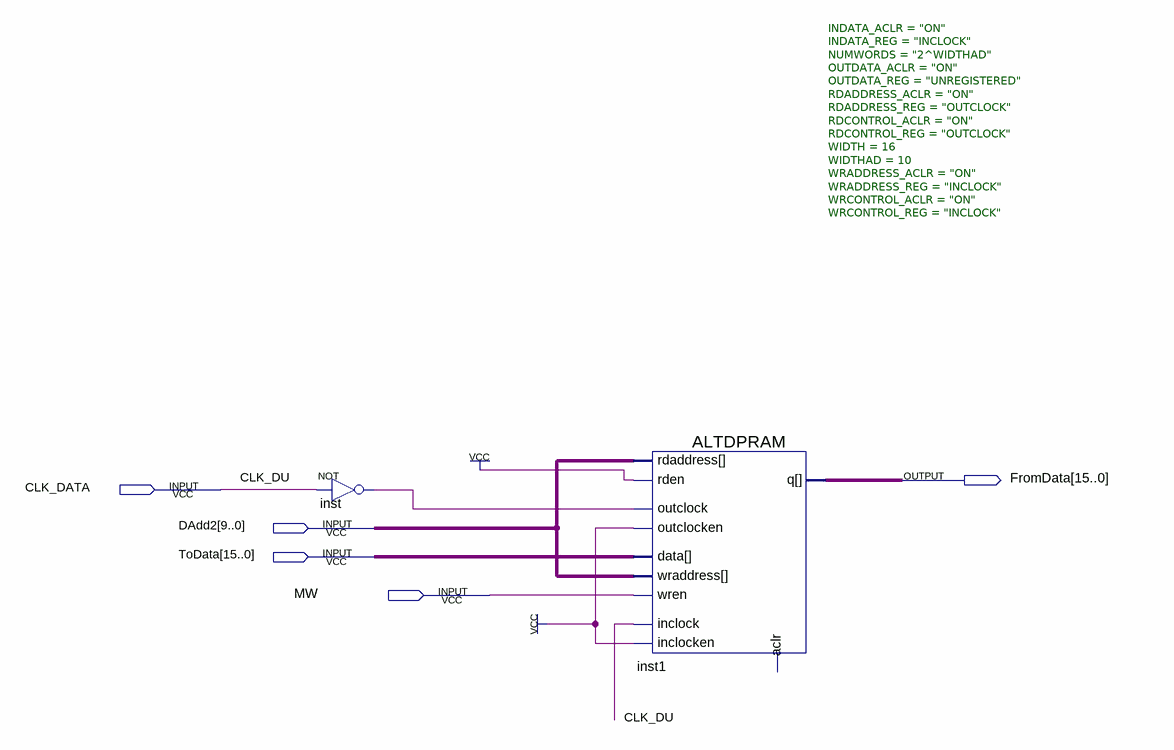
[diagram p0: schematic sheet]
// Quartus schematic dataUnit.bdf as structural Verilog: 2 symbols, 5 pins
module dataUnit (
  input  CLK_DATA,
  input  [9:0] DAdd2,
  input  [15:0] ToData,
  input  MW,
  output [15:0] FromData
);

  wire inst_out;

  not inst (inst_out, CLK_DATA);
  ALTDPRAM #(.INDATA_ACLR("ON"), .INDATA_REG("INCLOCK"), .NUMWORDS("2^WIDTHAD"), .OUTDATA_ACLR("ON"), .OUTDATA_REG("UNREGISTERED"), .RDADDRESS_ACLR("ON"), .RDADDRESS_REG("OUTCLOCK"), .RDCONTROL_ACLR("ON"), .RDCONTROL_REG("OUTCLOCK"), .WIDTH(16), .WIDTHAD(10), .WRADDRESS_ACLR("ON"), .WRADDRESS_REG("INCLOCK"), .WRCONTROL_ACLR("ON"), .WRCONTROL_REG("INCLOCK")) inst1 (
    .inclocken(1'b1), .inclock(CLK_DATA), .rdaddress(DAdd2), .rden(1'b1), .wraddress(DAdd2), .data(ToData),
    .outclock(inst_out), .outclocken(1'b1), .wren(MW), .q(FromData));  // open: aclr

  // Other names for the same wires on the sheet: CLK_DU = CLK_DATA
endmodule
